# EAGLE design endstop_ctl (EAGLE 7.1.0)
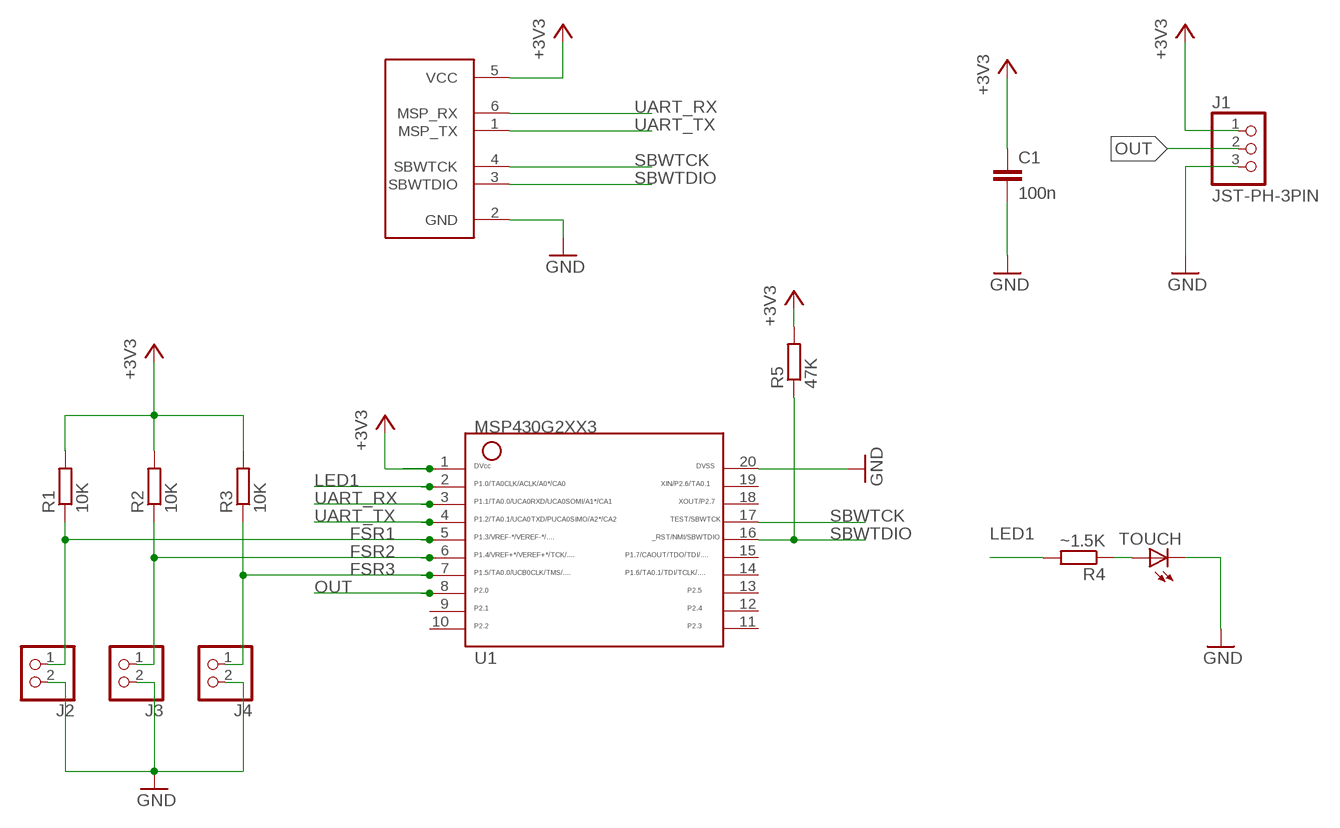
[diagram p0: schematic, sheet 1]

## Parts
C1  100n  C-EUC0603  [C0603]
J1  JST-PH-3PIN  [JST-PH-3PIN-PTH-RA]
J2  JST_2PIN-THM-RA  [JST-PH-2-THM-RA]
J3  JST_2PIN-THM-RA  [JST-PH-2-THM-RA]
J4  JST_2PIN-THM-RA  [JST-PH-2-THM-RA]
J5  MSP-SBWPTH  [MSP-SBW-0.05-PTH-90DEG]
R1  10K  R-EU_R0603  [R0603]
R2  10K  R-EU_R0603  [R0603]
R3  10K  R-EU_R0603  [R0603]
R4  ~1.5K  R-EU_R0603  [R0603]
R5  47K  R-EU_R0603  [R0603]
TOUCH  LED0603  [LED-0603]
U1  G2XX3---PW20  [PW20]

## Nets
+3V3: C1.1 J1.1 J5.5(VCC) R1.2 R2.2 R3.2 R5.2 U1.1
FSR1: J2.1 R1.1 U1.5
FSR2: J3.1 R2.1 U1.6
FSR3: J4.1 R3.1 U1.7
GND: C1.2 J1.3 J2.2 J3.2 J4.2 J5.2(GND) TOUCH.C U1.20
LED1: R4.2 U1.2
N$2: R4.1 TOUCH.A
OUT: J1.2 U1.8
SBWTCK: J5.4(SBWTCK) U1.17
SBWTDIO: J5.3(SBWTDIO) R5.1 U1.16
UART_RX: J5.6(MSP_RX) U1.3
UART_TX: J5.1(MSP_TX) U1.4
Unconnected: U1.9 U1.10 U1.11 U1.12 U1.13 U1.14 U1.15 U1.18 U1.19

## Library data of the parts
C1 = resistor:C-EU: CAPACITOR, European symbol
J1 = parts:JST-PH-3PIN
J2-J4 = adafruit:JST_2PIN: JST 2-Pin Connectors of various flavors SMT-RA (S2B-PH-SM4) 4UConnector #17311 SMT (B2B-PH-SM4) THM-RA (S2B-PH) THM (B2B-PH)
J5 = parts:MSP-SBW: MSP430 Spy-Bi-Wire connector
R1-R5 = resistor:R-EU_: RESISTOR, European symbol
TOUCH = SparkFun-LED:LED: LEDs Standard schematic elements and footprints for 5mm, 3mm, 1206, and 0603 sized LEDs. 5mm - Spark Fun Electronics SKU : COM-00529 (and others)
U1 = TI_MSP430_v16:G2XX3---PW20: MSP430G2XX1 TSSOP (PW) 20 Pin Package

## Board
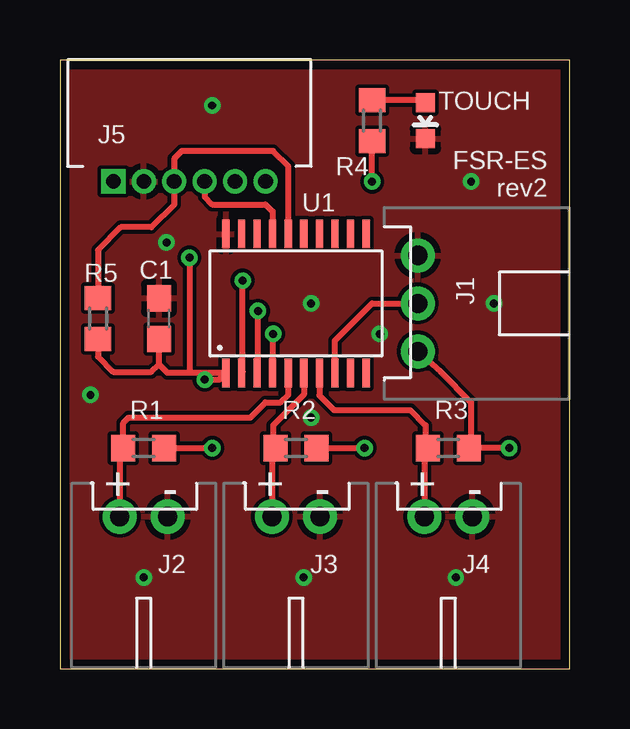
[diagram p1: board, top side]
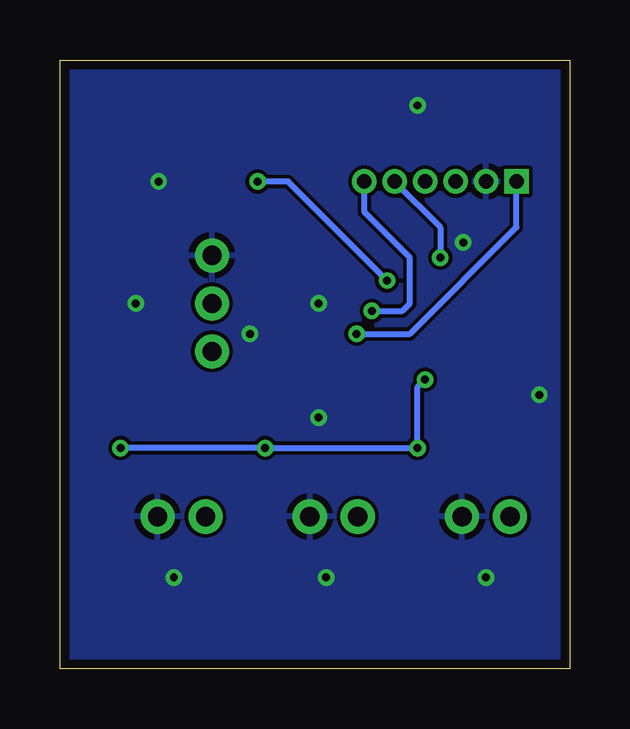
[diagram p2: board, bottom side, seen from below]

Size 21.26 x 25.39 mm. Coordinates in mm from the lower left corner, seen from the top.
Outline: 0,0 21.26,0 21.26,25.39 0,25.39 0,0
Copper layers (1*16): Top 0.0356mm / dielectric 1.5011mm / Bottom 0.0356mm
Design rules "LaenPCBOrder *": minimum track width 6mil, minimum drill 13mil, track to track 6mil, track to pad 6mil, pad to pad 6mil, via to via 6mil, smd to smd 6mil, copper to edge 15mil, drill to drill 6mil, minimum pad ring 7mil, minimum via ring 7mil, stop-mask expansion 4mil, vias tented up to drill 14mil, thermal gap 10mil

### Footprints (pad centres in the part's own frame; a part is rotated, then mirrored left to right if it is on the bottom)
C0603 = smd 1.1 x 1: 1 -0.85,0; 2 0.85,0
JST-PH-3PIN-PTH-RA = drill 0.8 pad 1.422: 1 2,-1.27; 2 0,-1.27; 3 -2,-1.27
JST-PH-2-THM-RA = drill 0.8 pad 1.422: 1 1,0; 2 -1,0
MSP-SBW-0.05-PTH-90DEG = drill 0.61 pad 1.016 square: 1 -3.81,0 | drill 0.61 pad 1.016: 2 -2.54,0; 3 -1.27,0; 4 0,0; 5 1.27,0; 6 2.54,0
R0603 = smd 1 x 1.1: 1 -0.85,0; 2 0.85,0
LED-0603 = smd 0.8 x 0.8: A 0,-0.75; C 0,0.75
PW20 = smd 0.3 x 1.2: 1 -2.925,-2.9; 2 -2.275,-2.9; 3 -1.625,-2.9; 4 -0.975,-2.9; 5 -0.325,-2.9; 6 0.325,-2.9; 7 0.975,-2.9; 8 1.625,-2.9; 9 2.275,-2.9; 10 2.925,-2.9; 11 2.925,2.9; 12 2.275,2.9; 13 1.625,2.9; 14 0.975,2.9; 15 0.325,2.9; 16 -0.325,2.9; 17 -0.975,2.9; 18 -1.625,2.9; 19 -2.275,2.9; 20 -2.925,2.9

### Placement (x,y rotation side)
C1  4.13,14.61 90 top
J1  16.19,15.24 270 top
J2  3.49,6.35 180 top
J3  9.84,6.35 180 top
J4  16.19,6.35 180 top
J5  6.03,20.32 0 top
R1  3.49,9.21 0 top
R2  9.84,9.21 0 top
R3  16.19,9.21 0 top
R4  13.02,22.86 270 top
R5  1.59,14.61 270 top
TOUCH  15.24,22.86 180 top
U1  9.84,15.24 0 top

### Tracks (layer width: path | path; a pad name or v marks a point on that pad's centre or on a via)
+3V3  (via drill 0.33)
  Top 0.254: R1.2 v6.35,9.21 | v6.03,12.06 6.64,12.06 U1.1 5.4,12.34 | 5.4,12.34 4.49,12.34 4.13,12.7 | 4.13,12.7 C1.1 | R5.2 1.59,13.02 2.22,12.38 3.81,12.38 4.13,12.7 | R2.2 v12.7,9.21 | v18.73,9.21 17.36,9.21 arc-90 R3.2 17.14,9.31 17.14,11.11 15.88,12.38 J1.1 | v5.4,17.14 5.4,12.34
  Bottom 0.254: v6.03,12.06 6.35,11.75 v6.35,9.21 v12.7,9.21 v18.73,9.21 | J5.5 5.4,18.41 v5.4,17.14
FSR1
  Top 0.254: J2.1 2.49,9.53 R1.1 2.64,10.26 2.86,10.48 7.94,10.48 8.57,11.11 9.21,11.11 9.53,11.43 U1.5
FSR2
  Top 0.254: J3.1 8.84,9.53 R2.1 8.89,9.31 8.89,10.16 10.17,11.44 U1.6
FSR3
  Top 0.254: J4.1 15.19,9.53 R3.1 15.24,9.63 15.24,10.16 14.61,10.79 11.43,10.79 10.82,11.41 U1.7
GND  (via drill 0.33)
  other vias: 3.49,3.81 10.16,3.81 16.51,3.81 10.48,10.48 1.27,11.43 4.45,17.78 18.1,15.24 10.48,15.24 13.34,13.97 6.35,23.5 17.14,20.32
  pour Top: 0,25.4 0,0 21.27,0 21.27,25.4
  pour Bottom: 0,25.4 0,0 21.27,0 21.27,25.4
LED1  (via drill 0.33)
  Top 0.254: U1.2 7.62,12.39 v7.62,16.19 | v13.02,20.32 R4.2
  Bottom 0.254: v7.62,16.19 11.75,20.32 v13.02,20.32
N$2
  Top 0.254: TOUCH.A 15.14,23.71 R4.1
OUT
  Top 0.254: U1.8 11.47,13.69 13.02,15.24 J1.2
SBWTCK
  Top 0.254: J5.4 6.03,19.68 6.35,19.37 8.57,19.37 8.87,19.07 U1.17
SBWTDIO
  Top 0.254: R5.1 1.59,17.46 2.54,18.41 3.81,18.41 4.76,19.37 J5.3 4.76,21.27 5.08,21.59 8.89,21.59 9.53,20.95 U1.16
UART_RX  (via drill 0.33)
  Top 0.254: U1.3 8.26,12.38 v8.26,14.92
  Bottom 0.254: v8.26,14.92 6.99,14.92 6.67,15.24 6.67,17.14 8.57,19.05 J5.6
UART_TX  (via drill 0.33)
  Top 0.254: U1.4 8.89,12.36 v8.89,13.97
  Bottom 0.254: v8.89,13.97 6.67,13.97 2.22,18.41 J5.1

### Text on the board
tNames: J5 | FSR-ES / rev2